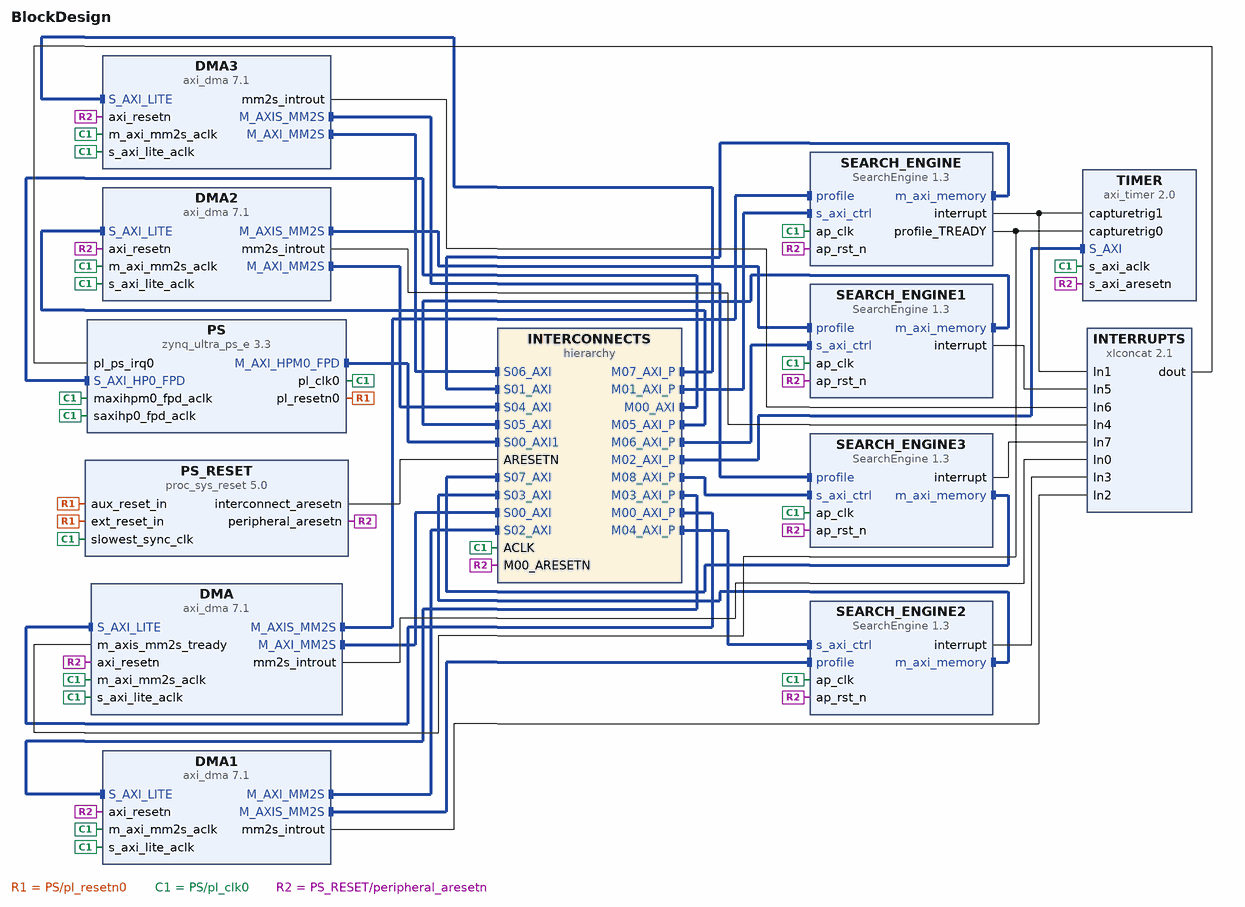
[diagram p0: block diagram of the top level]
# Vivado block design BlockDesign, xczu2cg-sfvc784-1-e, Vivado 2019.2
create_bd_design BlockDesign

create_bd_cell -type ip -vlnv xilinx.com:ip:proc_sys_reset:5.0 PS_RESET
create_bd_cell -type ip -vlnv xilinx.com:ip:axi_dma:7.1 DMA
set_property -dict [list \
  CONFIG.c_include_mm2s 1 \
  CONFIG.c_include_mm2s_dre 1 \
  CONFIG.c_include_s2mm 0 \
  CONFIG.c_include_sg 0 \
  CONFIG.c_m_axis_mm2s_tdata_width 8 \
  CONFIG.c_micro_dma 0 \
  CONFIG.c_mm2s_burst_size 256 \
  CONFIG.c_sg_length_width 26 \
] [get_bd_cells DMA]
create_bd_cell -type ip -vlnv xilinx.com:ip:xlconcat:2.1 INTERRUPTS
set_property -dict {CONFIG.NUM_PORTS 8} [get_bd_cells INTERRUPTS]
create_bd_cell -type hier INTERCONNECTS
create_bd_cell -type ip -vlnv xilinx.com:ip:axi_timer:2.0 TIMER
set_property -dict {CONFIG.TRIG0_ASSERT Active_Low CONFIG.mode_64bit 0} [get_bd_cells TIMER]
create_bd_cell -type ip -vlnv xilinx.com:ip:zynq_ultra_ps_e:3.3 PS
set_property -dict [list \
  CONFIG.PSU_BANK_0_IO_STANDARD LVCMOS18 \
  CONFIG.PSU_BANK_1_IO_STANDARD LVCMOS18 \
  CONFIG.PSU_BANK_2_IO_STANDARD LVCMOS18 \
  CONFIG.PSU_BANK_3_IO_STANDARD LVCMOS33 \
  CONFIG.PSU__CRF_APB__DDR_CTRL__FREQMHZ 1200 \
  CONFIG.PSU__CRF_APB__DDR_CTRL__SRCSEL DPLL \
  CONFIG.PSU__CRF_APB__DPDMA_REF_CTRL__SRCSEL APLL \
  CONFIG.PSU__CRF_APB__GDMA_REF_CTRL__SRCSEL APLL \
  CONFIG.PSU__CRF_APB__TOPSW_MAIN_CTRL__SRCSEL DPLL \
  CONFIG.PSU__CRL_APB__PL0_REF_CTRL__FREQMHZ 300 \
  CONFIG.PSU__CRL_APB__TIMESTAMP_REF_CTRL__SRCSEL IOPLL \
  CONFIG.PSU__DDRC__BUS_WIDTH {64 Bit} \
  CONFIG.PSU__DDRC__COMPONENTS Components \
  CONFIG.PSU__DDRC__DEVICE_CAPACITY {4096 MBits} \
  CONFIG.PSU__DDRC__DRAM_WIDTH {16 Bits} \
  CONFIG.PSU__DDRC__ECC Disabled \
  CONFIG.PSU__DDRC__MEMORY_TYPE {DDR 4} \
  CONFIG.PSU__DDRC__SPEED_BIN DDR4_2400P \
  CONFIG.PSU__DDR_HIGH_ADDRESS_GUI_ENABLE 0 \
  CONFIG.PSU__DDR__INTERFACE__FREQMHZ 600.000 \
  CONFIG.PSU__I2C1__PERIPHERAL__ENABLE 1 \
  CONFIG.PSU__I2C1__PERIPHERAL__IO {MIO 32 .. 33} \
  CONFIG.PSU__MAXIGP0__DATA_WIDTH 128 \
  CONFIG.PSU__PSS_REF_CLK__FREQMHZ 33.3333333333333 \
  CONFIG.PSU__TTC0__CLOCK__ENABLE 0 \
  CONFIG.PSU__TTC0__PERIPHERAL__ENABLE 1 \
  CONFIG.PSU__TTC0__WAVEOUT__ENABLE 0 \
  CONFIG.PSU__TTC1__CLOCK__ENABLE 0 \
  CONFIG.PSU__TTC1__PERIPHERAL__ENABLE 1 \
  CONFIG.PSU__TTC1__WAVEOUT__ENABLE 0 \
  CONFIG.PSU__TTC2__CLOCK__ENABLE 0 \
  CONFIG.PSU__TTC2__PERIPHERAL__ENABLE 1 \
  CONFIG.PSU__TTC2__WAVEOUT__ENABLE 0 \
  CONFIG.PSU__TTC3__CLOCK__ENABLE 0 \
  CONFIG.PSU__TTC3__PERIPHERAL__ENABLE 1 \
  CONFIG.PSU__TTC3__WAVEOUT__ENABLE 0 \
  CONFIG.PSU__UART1__BAUD_RATE 115200 \
  CONFIG.PSU__UART1__MODEM__ENABLE 0 \
  CONFIG.PSU__UART1__PERIPHERAL__ENABLE 1 \
  CONFIG.PSU__UART1__PERIPHERAL__IO {MIO 24 .. 25} \
  CONFIG.PSU__USE__IRQ0 1 \
  CONFIG.PSU__USE__M_AXI_GP0 1 \
  CONFIG.PSU__USE__M_AXI_GP2 0 \
  CONFIG.PSU__USE__S_AXI_GP2 1 \
  CONFIG.SUBPRESET1 DDR4_MICRON_MT40A256M16GE_083E \
] [get_bd_cells PS]
# 64 more settings of PS are not shown: defaults, MIO pin electricals, DDR timing, and values the tool derives
create_bd_cell -type ip -vlnv xilinx.com:ip:axi_dma:7.1 DMA1
set_property -dict [list \
  CONFIG.c_include_mm2s 1 \
  CONFIG.c_include_mm2s_dre 1 \
  CONFIG.c_include_s2mm 0 \
  CONFIG.c_include_sg 0 \
  CONFIG.c_m_axis_mm2s_tdata_width 8 \
  CONFIG.c_micro_dma 0 \
  CONFIG.c_mm2s_burst_size 256 \
  CONFIG.c_sg_length_width 26 \
] [get_bd_cells DMA1]
create_bd_cell -type ip -vlnv xilinx.com:ip:axi_dma:7.1 DMA2
set_property -dict [list \
  CONFIG.c_include_mm2s 1 \
  CONFIG.c_include_mm2s_dre 1 \
  CONFIG.c_include_s2mm 0 \
  CONFIG.c_include_sg 0 \
  CONFIG.c_m_axis_mm2s_tdata_width 8 \
  CONFIG.c_micro_dma 0 \
  CONFIG.c_mm2s_burst_size 256 \
  CONFIG.c_sg_length_width 26 \
] [get_bd_cells DMA2]
create_bd_cell -type ip -vlnv xilinx.com:ip:axi_dma:7.1 DMA3
set_property -dict [list \
  CONFIG.c_include_mm2s 1 \
  CONFIG.c_include_mm2s_dre 1 \
  CONFIG.c_include_s2mm 0 \
  CONFIG.c_include_sg 0 \
  CONFIG.c_m_axis_mm2s_tdata_width 8 \
  CONFIG.c_micro_dma 0 \
  CONFIG.c_mm2s_burst_size 256 \
  CONFIG.c_sg_length_width 26 \
] [get_bd_cells DMA3]
create_bd_cell -type ip -vlnv CorinneBP:hls:SearchEngine:1.3 SEARCH_ENGINE
create_bd_cell -type ip -vlnv CorinneBP:hls:SearchEngine:1.3 SEARCH_ENGINE1
create_bd_cell -type ip -vlnv CorinneBP:hls:SearchEngine:1.3 SEARCH_ENGINE2
create_bd_cell -type ip -vlnv CorinneBP:hls:SearchEngine:1.3 SEARCH_ENGINE3

# ---- hierarchy /INTERCONNECTS ----
current_bd_instance /INTERCONNECTS
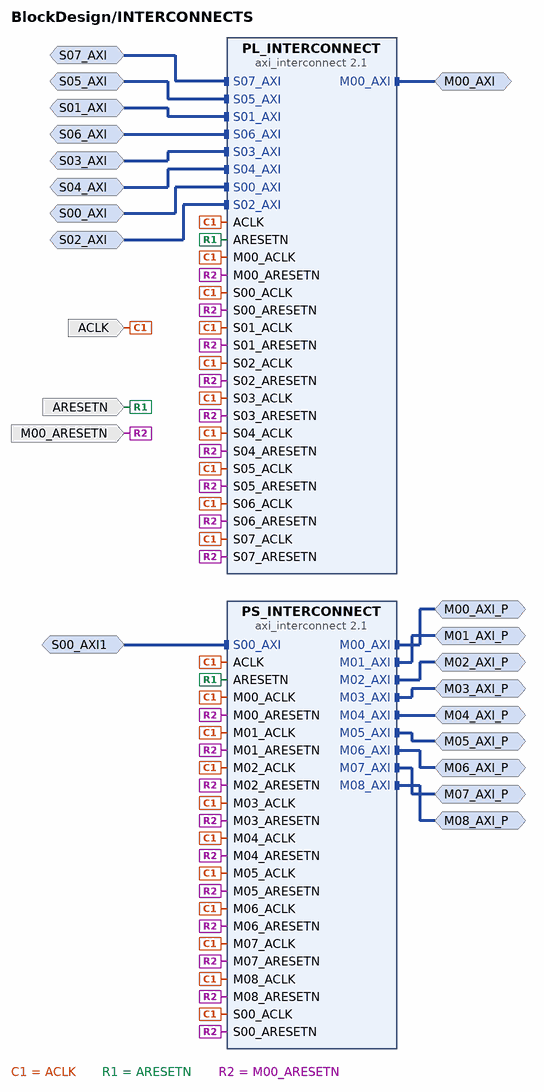
[diagram p1: block diagram inside /INTERCONNECTS]
create_bd_intf_pin -mode Slave -vlnv xilinx.com:interface:aximm_rtl:1.0 S00_AXI
create_bd_intf_pin -mode Master -vlnv xilinx.com:interface:aximm_rtl:1.0 M00_AXI
create_bd_intf_pin -mode Slave -vlnv xilinx.com:interface:aximm_rtl:1.0 S01_AXI
create_bd_intf_pin -mode Slave -vlnv xilinx.com:interface:aximm_rtl:1.0 S00_AXI1
create_bd_intf_pin -mode Master -vlnv xilinx.com:interface:aximm_rtl:1.0 M00_AXI_P
create_bd_intf_pin -mode Master -vlnv xilinx.com:interface:aximm_rtl:1.0 M01_AXI_P
create_bd_intf_pin -mode Master -vlnv xilinx.com:interface:aximm_rtl:1.0 M02_AXI_P
create_bd_intf_pin -mode Slave -vlnv xilinx.com:interface:aximm_rtl:1.0 S02_AXI
create_bd_intf_pin -mode Slave -vlnv xilinx.com:interface:aximm_rtl:1.0 S03_AXI
create_bd_intf_pin -mode Slave -vlnv xilinx.com:interface:aximm_rtl:1.0 S04_AXI
create_bd_intf_pin -mode Slave -vlnv xilinx.com:interface:aximm_rtl:1.0 S05_AXI
create_bd_intf_pin -mode Slave -vlnv xilinx.com:interface:aximm_rtl:1.0 S06_AXI
create_bd_intf_pin -mode Slave -vlnv xilinx.com:interface:aximm_rtl:1.0 S07_AXI
create_bd_intf_pin -mode Master -vlnv xilinx.com:interface:aximm_rtl:1.0 M03_AXI_P
create_bd_intf_pin -mode Master -vlnv xilinx.com:interface:aximm_rtl:1.0 M04_AXI_P
create_bd_intf_pin -mode Master -vlnv xilinx.com:interface:aximm_rtl:1.0 M05_AXI_P
create_bd_intf_pin -mode Master -vlnv xilinx.com:interface:aximm_rtl:1.0 M06_AXI_P
create_bd_intf_pin -mode Master -vlnv xilinx.com:interface:aximm_rtl:1.0 M07_AXI_P
create_bd_intf_pin -mode Master -vlnv xilinx.com:interface:aximm_rtl:1.0 M08_AXI_P
create_bd_pin -dir I -type clk ACLK
create_bd_pin -dir I -type rst ARESETN
create_bd_pin -dir I -type rst M00_ARESETN

create_bd_cell -type ip -vlnv xilinx.com:ip:axi_interconnect:2.1 PL_INTERCONNECT
set_property -dict [list \
  CONFIG.ENABLE_ADVANCED_OPTIONS 0 \
  CONFIG.NUM_MI 1 \
  CONFIG.NUM_SI 8 \
  CONFIG.S00_HAS_REGSLICE 4 \
] [get_bd_cells PL_INTERCONNECT]
create_bd_cell -type ip -vlnv xilinx.com:ip:axi_interconnect:2.1 PS_INTERCONNECT
set_property -dict {CONFIG.NUM_MI 9} [get_bd_cells PS_INTERCONNECT]

# ---- connections ----

current_bd_instance /INTERCONNECTS
connect_bd_intf_net [get_bd_intf_pins M03_AXI_P] [get_bd_intf_pins PS_INTERCONNECT/M03_AXI]
connect_bd_intf_net [get_bd_intf_pins M06_AXI_P] [get_bd_intf_pins PS_INTERCONNECT/M06_AXI]
connect_bd_intf_net [get_bd_intf_pins S07_AXI] [get_bd_intf_pins PL_INTERCONNECT/S07_AXI]
connect_bd_intf_net [get_bd_intf_pins M04_AXI_P] [get_bd_intf_pins PS_INTERCONNECT/M04_AXI]
connect_bd_intf_net [get_bd_intf_pins S05_AXI] [get_bd_intf_pins PL_INTERCONNECT/S05_AXI]
connect_bd_intf_net [get_bd_intf_pins M08_AXI_P] [get_bd_intf_pins PS_INTERCONNECT/M08_AXI]
connect_bd_intf_net [get_bd_intf_pins S01_AXI] [get_bd_intf_pins PL_INTERCONNECT/S01_AXI]
connect_bd_intf_net [get_bd_intf_pins S06_AXI] [get_bd_intf_pins PL_INTERCONNECT/S06_AXI]
connect_bd_intf_net [get_bd_intf_pins S00_AXI1] [get_bd_intf_pins PS_INTERCONNECT/S00_AXI]
connect_bd_intf_net [get_bd_intf_pins S03_AXI] [get_bd_intf_pins PL_INTERCONNECT/S03_AXI]
connect_bd_intf_net [get_bd_intf_pins M00_AXI_P] [get_bd_intf_pins PS_INTERCONNECT/M00_AXI]
connect_bd_intf_net [get_bd_intf_pins S04_AXI] [get_bd_intf_pins PL_INTERCONNECT/S04_AXI]
connect_bd_intf_net [get_bd_intf_pins S00_AXI] [get_bd_intf_pins PL_INTERCONNECT/S00_AXI]
connect_bd_intf_net [get_bd_intf_pins M05_AXI_P] [get_bd_intf_pins PS_INTERCONNECT/M05_AXI]
connect_bd_intf_net [get_bd_intf_pins M07_AXI_P] [get_bd_intf_pins PS_INTERCONNECT/M07_AXI]
connect_bd_intf_net [get_bd_intf_pins S02_AXI] [get_bd_intf_pins PL_INTERCONNECT/S02_AXI]
connect_bd_intf_net [get_bd_intf_pins M02_AXI_P] [get_bd_intf_pins PS_INTERCONNECT/M02_AXI]
connect_bd_intf_net [get_bd_intf_pins M00_AXI] [get_bd_intf_pins PL_INTERCONNECT/M00_AXI]
connect_bd_intf_net [get_bd_intf_pins M01_AXI_P] [get_bd_intf_pins PS_INTERCONNECT/M01_AXI]
connect_bd_net -net PS_pl_clk0 [get_bd_pins ACLK] \
  [get_bd_pins PS_INTERCONNECT/ACLK] [get_bd_pins PS_INTERCONNECT/S00_ACLK] [get_bd_pins PS_INTERCONNECT/M00_ACLK] \
  [get_bd_pins PS_INTERCONNECT/M01_ACLK] [get_bd_pins PL_INTERCONNECT/S00_ACLK] [get_bd_pins PL_INTERCONNECT/M00_ACLK] \
  [get_bd_pins PL_INTERCONNECT/S01_ACLK] [get_bd_pins PL_INTERCONNECT/ACLK] [get_bd_pins PS_INTERCONNECT/M02_ACLK] \
  [get_bd_pins PL_INTERCONNECT/S02_ACLK] [get_bd_pins PL_INTERCONNECT/S03_ACLK] [get_bd_pins PL_INTERCONNECT/S04_ACLK] \
  [get_bd_pins PL_INTERCONNECT/S05_ACLK] [get_bd_pins PL_INTERCONNECT/S06_ACLK] [get_bd_pins PL_INTERCONNECT/S07_ACLK] \
  [get_bd_pins PS_INTERCONNECT/M03_ACLK] [get_bd_pins PS_INTERCONNECT/M04_ACLK] [get_bd_pins PS_INTERCONNECT/M05_ACLK] \
  [get_bd_pins PS_INTERCONNECT/M06_ACLK] [get_bd_pins PS_INTERCONNECT/M07_ACLK] [get_bd_pins PS_INTERCONNECT/M08_ACLK]
connect_bd_net [get_bd_pins ARESETN] [get_bd_pins PS_INTERCONNECT/ARESETN] [get_bd_pins PL_INTERCONNECT/ARESETN]
connect_bd_net -net S00_ARESETN_1 [get_bd_pins M00_ARESETN] \
  [get_bd_pins PL_INTERCONNECT/M00_ARESETN] [get_bd_pins PS_INTERCONNECT/S00_ARESETN] \
  [get_bd_pins PS_INTERCONNECT/M00_ARESETN] [get_bd_pins PS_INTERCONNECT/M01_ARESETN] \
  [get_bd_pins PL_INTERCONNECT/S01_ARESETN] [get_bd_pins PL_INTERCONNECT/S00_ARESETN] \
  [get_bd_pins PS_INTERCONNECT/M02_ARESETN] [get_bd_pins PL_INTERCONNECT/S07_ARESETN] \
  [get_bd_pins PL_INTERCONNECT/S02_ARESETN] [get_bd_pins PL_INTERCONNECT/S03_ARESETN] \
  [get_bd_pins PL_INTERCONNECT/S04_ARESETN] [get_bd_pins PL_INTERCONNECT/S05_ARESETN] \
  [get_bd_pins PL_INTERCONNECT/S06_ARESETN] [get_bd_pins PS_INTERCONNECT/M03_ARESETN] \
  [get_bd_pins PS_INTERCONNECT/M04_ARESETN] [get_bd_pins PS_INTERCONNECT/M05_ARESETN] \
  [get_bd_pins PS_INTERCONNECT/M06_ARESETN] [get_bd_pins PS_INTERCONNECT/M07_ARESETN] \
  [get_bd_pins PS_INTERCONNECT/M08_ARESETN]

current_bd_instance /
connect_bd_intf_net [get_bd_intf_pins INTERCONNECTS/M07_AXI_P] [get_bd_intf_pins DMA3/S_AXI_LITE]
connect_bd_intf_net [get_bd_intf_pins INTERCONNECTS/S03_AXI] [get_bd_intf_pins SEARCH_ENGINE2/m_axi_memory]
connect_bd_intf_net [get_bd_intf_pins INTERCONNECTS/M08_AXI_P] [get_bd_intf_pins SEARCH_ENGINE3/s_axi_ctrl]
connect_bd_intf_net [get_bd_intf_pins INTERCONNECTS/M05_AXI_P] [get_bd_intf_pins DMA2/S_AXI_LITE]
connect_bd_intf_net [get_bd_intf_pins INTERCONNECTS/M00_AXI] [get_bd_intf_pins PS/S_AXI_HP0_FPD]
connect_bd_intf_net [get_bd_intf_pins DMA/M_AXIS_MM2S] [get_bd_intf_pins SEARCH_ENGINE/profile]
connect_bd_intf_net [get_bd_intf_pins INTERCONNECTS/S00_AXI] [get_bd_intf_pins DMA/M_AXI_MM2S]
connect_bd_intf_net [get_bd_intf_pins INTERCONNECTS/M06_AXI_P] [get_bd_intf_pins SEARCH_ENGINE1/s_axi_ctrl]
connect_bd_intf_net [get_bd_intf_pins INTERCONNECTS/S05_AXI] [get_bd_intf_pins SEARCH_ENGINE1/m_axi_memory]
connect_bd_intf_net [get_bd_intf_pins INTERCONNECTS/S06_AXI] [get_bd_intf_pins DMA3/M_AXI_MM2S]
connect_bd_intf_net [get_bd_intf_pins INTERCONNECTS/M02_AXI_P] [get_bd_intf_pins TIMER/S_AXI]
connect_bd_intf_net [get_bd_intf_pins DMA2/M_AXIS_MM2S] [get_bd_intf_pins SEARCH_ENGINE1/profile]
connect_bd_intf_net [get_bd_intf_pins INTERCONNECTS/S07_AXI] [get_bd_intf_pins SEARCH_ENGINE3/m_axi_memory]
connect_bd_intf_net [get_bd_intf_pins DMA1/M_AXIS_MM2S] [get_bd_intf_pins SEARCH_ENGINE2/profile]
connect_bd_intf_net [get_bd_intf_pins INTERCONNECTS/M04_AXI_P] [get_bd_intf_pins SEARCH_ENGINE2/s_axi_ctrl]
connect_bd_intf_net -intf_net PS_INTERCONNECT_M00_AXI [get_bd_intf_pins DMA/S_AXI_LITE] [get_bd_intf_pins INTERCONNECTS/M00_AXI_P]
connect_bd_intf_net [get_bd_intf_pins INTERCONNECTS/M03_AXI_P] [get_bd_intf_pins DMA1/S_AXI_LITE]
connect_bd_intf_net -intf_net S00_AXI1_1 [get_bd_intf_pins INTERCONNECTS/S00_AXI1] [get_bd_intf_pins PS/M_AXI_HPM0_FPD]
connect_bd_intf_net [get_bd_intf_pins DMA3/M_AXIS_MM2S] [get_bd_intf_pins SEARCH_ENGINE3/profile]
connect_bd_intf_net [get_bd_intf_pins INTERCONNECTS/S01_AXI] [get_bd_intf_pins SEARCH_ENGINE/m_axi_memory]
connect_bd_intf_net [get_bd_intf_pins INTERCONNECTS/M01_AXI_P] [get_bd_intf_pins SEARCH_ENGINE/s_axi_ctrl]
connect_bd_intf_net [get_bd_intf_pins INTERCONNECTS/S04_AXI] [get_bd_intf_pins DMA2/M_AXI_MM2S]
connect_bd_intf_net [get_bd_intf_pins INTERCONNECTS/S02_AXI] [get_bd_intf_pins DMA1/M_AXI_MM2S]
connect_bd_net [get_bd_pins PS/pl_resetn0] [get_bd_pins PS_RESET/ext_reset_in] [get_bd_pins PS_RESET/aux_reset_in]
connect_bd_net [get_bd_pins PS/pl_clk0] \
  [get_bd_pins PS_RESET/slowest_sync_clk] [get_bd_pins DMA/m_axi_mm2s_aclk] [get_bd_pins DMA/s_axi_lite_aclk] \
  [get_bd_pins INTERCONNECTS/ACLK] [get_bd_pins TIMER/s_axi_aclk] [get_bd_pins PS/maxihpm0_fpd_aclk] \
  [get_bd_pins PS/saxihp0_fpd_aclk] [get_bd_pins DMA1/s_axi_lite_aclk] [get_bd_pins DMA2/s_axi_lite_aclk] \
  [get_bd_pins DMA3/s_axi_lite_aclk] [get_bd_pins DMA3/m_axi_mm2s_aclk] [get_bd_pins DMA2/m_axi_mm2s_aclk] \
  [get_bd_pins DMA1/m_axi_mm2s_aclk] [get_bd_pins SEARCH_ENGINE/ap_clk] [get_bd_pins SEARCH_ENGINE1/ap_clk] \
  [get_bd_pins SEARCH_ENGINE2/ap_clk] [get_bd_pins SEARCH_ENGINE3/ap_clk]
connect_bd_net [get_bd_pins DMA/mm2s_introut] [get_bd_pins INTERRUPTS/In0]
connect_bd_net -net ARESETN_1 [get_bd_pins PS_RESET/interconnect_aresetn] [get_bd_pins INTERCONNECTS/ARESETN]
connect_bd_net [get_bd_pins PS_RESET/peripheral_aresetn] \
  [get_bd_pins INTERCONNECTS/M00_ARESETN] [get_bd_pins DMA/axi_resetn] [get_bd_pins DMA1/axi_resetn] \
  [get_bd_pins DMA2/axi_resetn] [get_bd_pins DMA3/axi_resetn] [get_bd_pins TIMER/s_axi_aresetn] \
  [get_bd_pins SEARCH_ENGINE/ap_rst_n] [get_bd_pins SEARCH_ENGINE1/ap_rst_n] [get_bd_pins SEARCH_ENGINE2/ap_rst_n] \
  [get_bd_pins SEARCH_ENGINE3/ap_rst_n]
connect_bd_net -net SearchEngine_0_interrupt [get_bd_pins SEARCH_ENGINE/interrupt] [get_bd_pins INTERRUPTS/In1] [get_bd_pins TIMER/capturetrig1]
connect_bd_net [get_bd_pins INTERRUPTS/dout] [get_bd_pins PS/pl_ps_irq0]
connect_bd_net [get_bd_pins DMA1/mm2s_introut] [get_bd_pins INTERRUPTS/In2]
connect_bd_net [get_bd_pins SEARCH_ENGINE2/interrupt] [get_bd_pins INTERRUPTS/In3]
connect_bd_net [get_bd_pins DMA2/mm2s_introut] [get_bd_pins INTERRUPTS/In4]
connect_bd_net [get_bd_pins SEARCH_ENGINE1/interrupt] [get_bd_pins INTERRUPTS/In5]
connect_bd_net [get_bd_pins DMA3/mm2s_introut] [get_bd_pins INTERRUPTS/In6]
connect_bd_net [get_bd_pins SEARCH_ENGINE3/interrupt] [get_bd_pins INTERRUPTS/In7]
connect_bd_net [get_bd_pins SEARCH_ENGINE/profile_TREADY] [get_bd_pins DMA/m_axis_mm2s_tready] [get_bd_pins TIMER/capturetrig0]

# ---- address map ----
assign_bd_address -offset 0x00000000 -range 2G -target_address_space [get_bd_addr_spaces DMA1/Data_MM2S] [get_bd_addr_segs PS/SAXIGP2/HP0_DDR_LOW]
assign_bd_address -offset 0x00000000 -range 2G -target_address_space [get_bd_addr_spaces DMA2/Data_MM2S] [get_bd_addr_segs PS/SAXIGP2/HP0_DDR_LOW]
assign_bd_address -offset 0x00000000 -range 2G -target_address_space [get_bd_addr_spaces DMA3/Data_MM2S] [get_bd_addr_segs PS/SAXIGP2/HP0_DDR_LOW]
assign_bd_address -offset 0x00000000 -range 2G -target_address_space [get_bd_addr_spaces DMA/Data_MM2S] [get_bd_addr_segs PS/SAXIGP2/HP0_DDR_LOW]
assign_bd_address -offset 0x00A0000000 -range 64K -target_address_space [get_bd_addr_spaces PS/Data] [get_bd_addr_segs DMA/S_AXI_LITE/Reg]
assign_bd_address -offset 0x00A0010000 -range 64K -target_address_space [get_bd_addr_spaces PS/Data] [get_bd_addr_segs DMA1/S_AXI_LITE/Reg]
assign_bd_address -offset 0x00A0020000 -range 64K -target_address_space [get_bd_addr_spaces PS/Data] [get_bd_addr_segs DMA2/S_AXI_LITE/Reg]
assign_bd_address -offset 0x00A0030000 -range 64K -target_address_space [get_bd_addr_spaces PS/Data] [get_bd_addr_segs DMA3/S_AXI_LITE/Reg]
assign_bd_address -offset 0x00A0040000 -range 64K -target_address_space [get_bd_addr_spaces PS/Data] [get_bd_addr_segs SEARCH_ENGINE/s_axi_ctrl/Reg]
assign_bd_address -offset 0x00A0050000 -range 64K -target_address_space [get_bd_addr_spaces PS/Data] [get_bd_addr_segs SEARCH_ENGINE1/s_axi_ctrl/Reg]
assign_bd_address -offset 0x00A0060000 -range 64K -target_address_space [get_bd_addr_spaces PS/Data] [get_bd_addr_segs SEARCH_ENGINE2/s_axi_ctrl/Reg]
assign_bd_address -offset 0x00A0070000 -range 64K -target_address_space [get_bd_addr_spaces PS/Data] [get_bd_addr_segs SEARCH_ENGINE3/s_axi_ctrl/Reg]
assign_bd_address -offset 0x00A0080000 -range 64K -target_address_space [get_bd_addr_spaces PS/Data] [get_bd_addr_segs TIMER/S_AXI/Reg]
assign_bd_address -offset 0x00000000 -range 2G -target_address_space [get_bd_addr_spaces SEARCH_ENGINE1/Data_m_axi_memory] [get_bd_addr_segs PS/SAXIGP2/HP0_DDR_LOW]
assign_bd_address -offset 0x00000000 -range 2G -target_address_space [get_bd_addr_spaces SEARCH_ENGINE2/Data_m_axi_memory] [get_bd_addr_segs PS/SAXIGP2/HP0_DDR_LOW]
assign_bd_address -offset 0x00000000 -range 2G -target_address_space [get_bd_addr_spaces SEARCH_ENGINE3/Data_m_axi_memory] [get_bd_addr_segs PS/SAXIGP2/HP0_DDR_LOW]
assign_bd_address -offset 0x00000000 -range 2G -target_address_space [get_bd_addr_spaces SEARCH_ENGINE/Data_m_axi_memory] [get_bd_addr_segs PS/SAXIGP2/HP0_DDR_LOW]

validate_bd_design
save_bd_design
